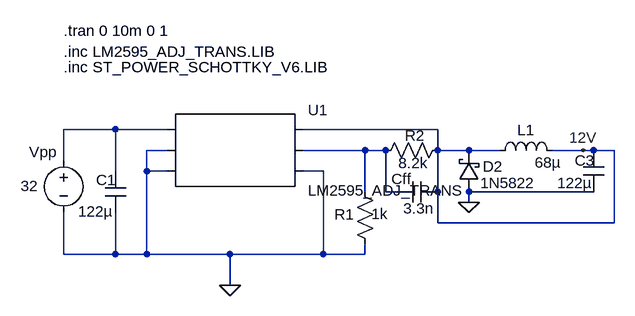
[diagram p0: schematic Switchmode.asc]
Switchmode.asc, the LTspice schematic file:
Version 4
SHEET 1 880 680
WIRE 32 176 -48 176
WIRE 112 176 32 176
WIRE 528 176 320 176
WIRE 112 208 80 208
WIRE 416 208 320 208
WIRE 448 208 416 208
WIRE 528 208 528 176
WIRE 576 208 528 208
WIRE 624 208 576 208
WIRE 752 208 704 208
WIRE 768 208 752 208
WIRE 800 208 768 208
WIRE -48 224 -48 176
WIRE 32 240 32 176
WIRE 80 240 80 208
WIRE 112 240 80 240
WIRE 352 240 320 240
WIRE 416 272 416 208
WIRE 448 272 448 208
WIRE 464 272 448 272
WIRE 528 272 528 208
WIRE 768 272 576 272
WIRE 576 288 576 272
WIRE 528 320 528 272
WIRE 800 320 800 208
WIRE 800 320 528 320
WIRE -48 368 -48 304
WIRE 32 368 32 304
WIRE 32 368 -48 368
WIRE 80 368 80 240
WIRE 80 368 32 368
WIRE 208 368 80 368
WIRE 352 368 352 240
WIRE 352 368 208 368
WIRE 416 368 416 352
WIRE 416 368 352 368
WIRE 208 416 208 368
FLAG 208 416 0
FLAG 576 288 0
FLAG 752 208 12V
SYMBOL voltage -48 208 R0
WINDOW 123 0 0 Left 2
WINDOW 39 0 0 Left 2
WINDOW 0 -53 3 Left 2
WINDOW 3 -66 55 Left 2
SYMATTR InstName Vpp
SYMATTR Value 32
SYMBOL cap 16 240 R0
WINDOW 3 -42 62 Left 2
WINDOW 0 -14 14 Left 2
SYMATTR Value 122µ
SYMATTR InstName C1
SYMBOL schottky 592 272 R180
WINDOW 0 -36 39 Left 2
WINDOW 3 -86 14 Left 2
SYMATTR InstName D2
SYMATTR Value 1N5822
SYMBOL res 400 256 R0
WINDOW 0 -31 51 Left 2
WINDOW 3 26 50 Left 2
SYMATTR InstName R1
SYMATTR Value 1k
SYMBOL res 544 192 R90
WINDOW 0 9 51 VBottom 2
WINDOW 3 20 54 VTop 2
SYMATTR InstName R2
SYMATTR Value 8.2k
SYMBOL cap 528 256 R90
WINDOW 0 12 56 VBottom 2
WINDOW 3 26 29 VTop 2
SYMATTR InstName Cff
SYMATTR Value 3.3n
SYMBOL ind 608 224 R270
WINDOW 0 32 56 VTop 2
WINDOW 3 13 90 VBottom 2
SYMATTR InstName L1
SYMATTR Value 68µ
SYMBOL cap 752 208 R0
WINDOW 0 -13 16 Left 2
WINDOW 3 -40 50 Left 2
SYMATTR InstName C3
SYMATTR Value 122µ
SYMBOL AutoGenerated\\LM2595_ADJ_TRANS 208 208 R0
SYMATTR InstName U1
TEXT -48 56 Left 2 !.inc LM2595_ADJ_TRANS.LIB
TEXT -48 80 Left 2 !.inc ST_POWER_SCHOTTKY_V6.LIB
TEXT -48 24 Left 2 !.tran 0 10m 0 1

The netlist it stands for:
* Switchmode.asc
Vpp N001 0 32
C1 N001 0 122µ
D2 0 12V 1N5822
R1 N002 0 1k
R2 12V N002 8.2k
Cff 12V N002 3.3n
L1 12V 12V 68µ
C3 12V 0 122µ
* U1: LM2595_ADJ_TRANS (symbol AutoGenerated\LM2595_ADJ_TRANS not available, pins judged from their places): pin1=N001 pin2=0 pin3=0 pin4=12V pin5=N002 pin6=0
.model D D
.lib standard.dio
.inc LM2595_ADJ_TRANS.LIB
.inc ST_POWER_SCHOTTKY_V6.LIB
.tran 0 10m 0 1
.backanno
.end